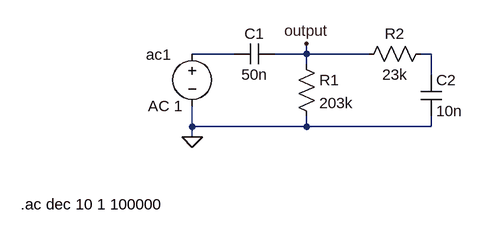
[diagram p0: schematic band pass.asc]
band pass.asc, the LTspice schematic file:
Version 4
SHEET 1 880 680
WIRE 96 112 32 112
WIRE 208 112 208 96
WIRE 208 112 160 112
WIRE 304 112 208 112
WIRE 400 112 384 112
WIRE 208 128 208 112
WIRE 400 144 400 112
WIRE 32 224 32 192
WIRE 208 224 208 208
WIRE 208 224 32 224
WIRE 400 224 400 208
WIRE 400 224 208 224
WIRE 32 240 32 224
FLAG 32 240 0
FLAG 208 96 output
SYMBOL cap 96 128 R270
WINDOW 0 32 32 VTop 2
WINDOW 3 0 32 VBottom 2
SYMATTR InstName C1
SYMATTR Value 50n
SYMBOL res 192 112 R0
SYMATTR InstName R1
SYMATTR Value 203k
SYMBOL voltage 32 96 R0
WINDOW 0 -71 17 Left 2
WINDOW 3 -68 96 Left 2
WINDOW 123 0 0 Left 2
WINDOW 39 0 0 Left 2
SYMATTR InstName ac1
SYMATTR Value AC 1
SYMBOL res 400 96 R90
WINDOW 0 0 56 VBottom 2
WINDOW 3 32 56 VTop 2
SYMATTR InstName R2
SYMATTR Value 23k
SYMBOL cap 384 144 R0
SYMATTR InstName C2
SYMATTR Value 10n
TEXT -232 344 Left 2 !.ac dec 10 1 100000

The netlist it stands for:
* band pass.asc
C1 N001 output 50n
R1 output 0 203k
V§ac1 N001 0 AC 1
R2 N002 output 23k
C2 N002 0 10n
.ac dec 10 1 100000
.backanno
.end